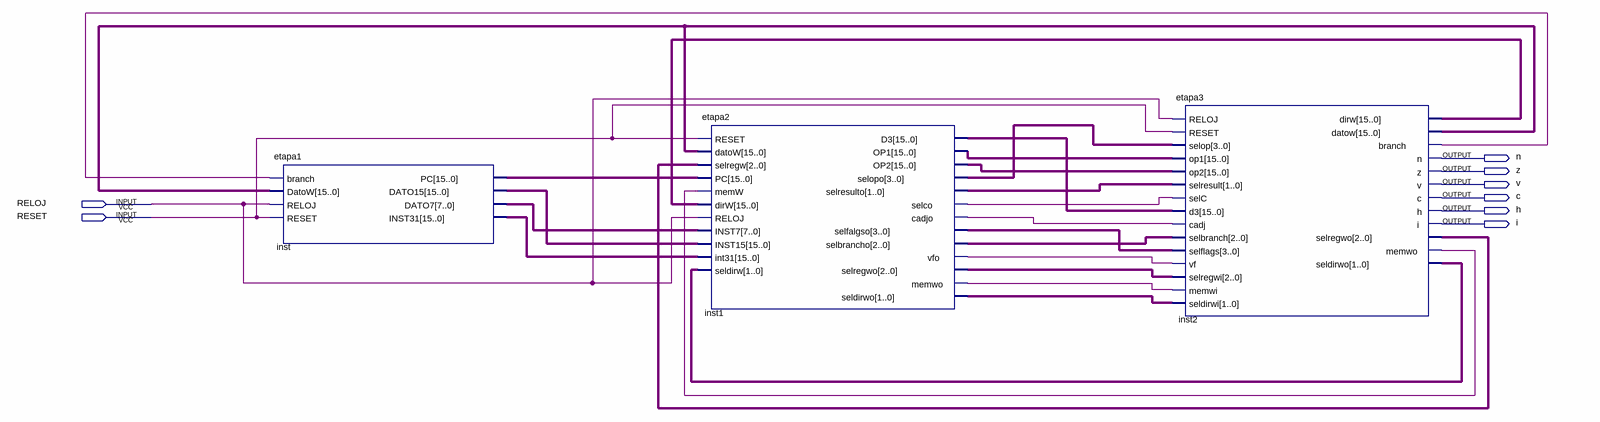
[diagram p0: schematic sheet]
// Quartus schematic pipeline.bdf as structural Verilog: 3 symbols, 8 pins
module pipeline (
  input  RELOJ,
  input  RESET,
  output n,
  output z,
  output v,
  output c,
  output h,
  output i
);

  wire inst1_cadjo, inst1_memwo, inst1_selco, inst1_vfo, inst2_branch, inst2_memwo;
  wire [1:0] inst1_seldirwo, inst1_selresulto, inst2_seldirwo;
  wire [2:0] inst1_selbrancho, inst1_selregwo, inst2_selregwo;
  wire [3:0] inst1_selfalgso, inst1_selopo;
  wire [7:0] inst_dato7;
  wire [15:0] inst1_d3, inst1_op1, inst1_op2, inst2_datow, inst2_dirw, inst_dato15, inst_inst31, inst_pc;

  etapa1 inst (
    .branch(inst2_branch), .DatoW(inst2_datow), .RELOJ(RELOJ), .RESET(RESET), .PC(inst_pc),
    .DATO15(inst_dato15), .DATO7(inst_dato7), .INST31(inst_inst31));
  etapa2 inst1 (
    .RESET(RESET), .datoW(inst2_datow), .selregw(inst2_selregwo), .PC(inst_pc), .memW(inst2_memwo),
    .dirW(inst2_dirw), .RELOJ(RELOJ), .INST7(inst_dato7), .INST15(inst_dato15), .int31(inst_inst31),
    .seldirw(inst2_seldirwo), .D3(inst1_d3), .OP1(inst1_op1), .OP2(inst1_op2), .selopo(inst1_selopo),
    .selresulto(inst1_selresulto), .selco(inst1_selco), .cadjo(inst1_cadjo), .selfalgso(inst1_selfalgso),
    .selbrancho(inst1_selbrancho), .vfo(inst1_vfo), .selregwo(inst1_selregwo), .memwo(inst1_memwo),
    .seldirwo(inst1_seldirwo));
  etapa3 inst2 (
    .RELOJ(RELOJ), .RESET(RESET), .selop(inst1_selopo), .op1(inst1_op1), .op2(inst1_op2),
    .selresult(inst1_selresulto), .selC(inst1_selco), .d3(inst1_d3), .cadj(inst1_cadjo),
    .selbranch(inst1_selbrancho), .selflags(inst1_selfalgso), .vf(inst1_vfo), .selregwi(inst1_selregwo),
    .memwi(inst1_memwo), .seldirwi(inst1_seldirwo), .dirw(inst2_dirw), .datow(inst2_datow),
    .branch(inst2_branch), .n(n), .z(z), .v(v), .c(c), .h(h), .i(i), .selregwo(inst2_selregwo),
    .memwo(inst2_memwo), .seldirwo(inst2_seldirwo));
endmodule
